# EAGLE design X13-Backplane (EAGLE 9.6.2)
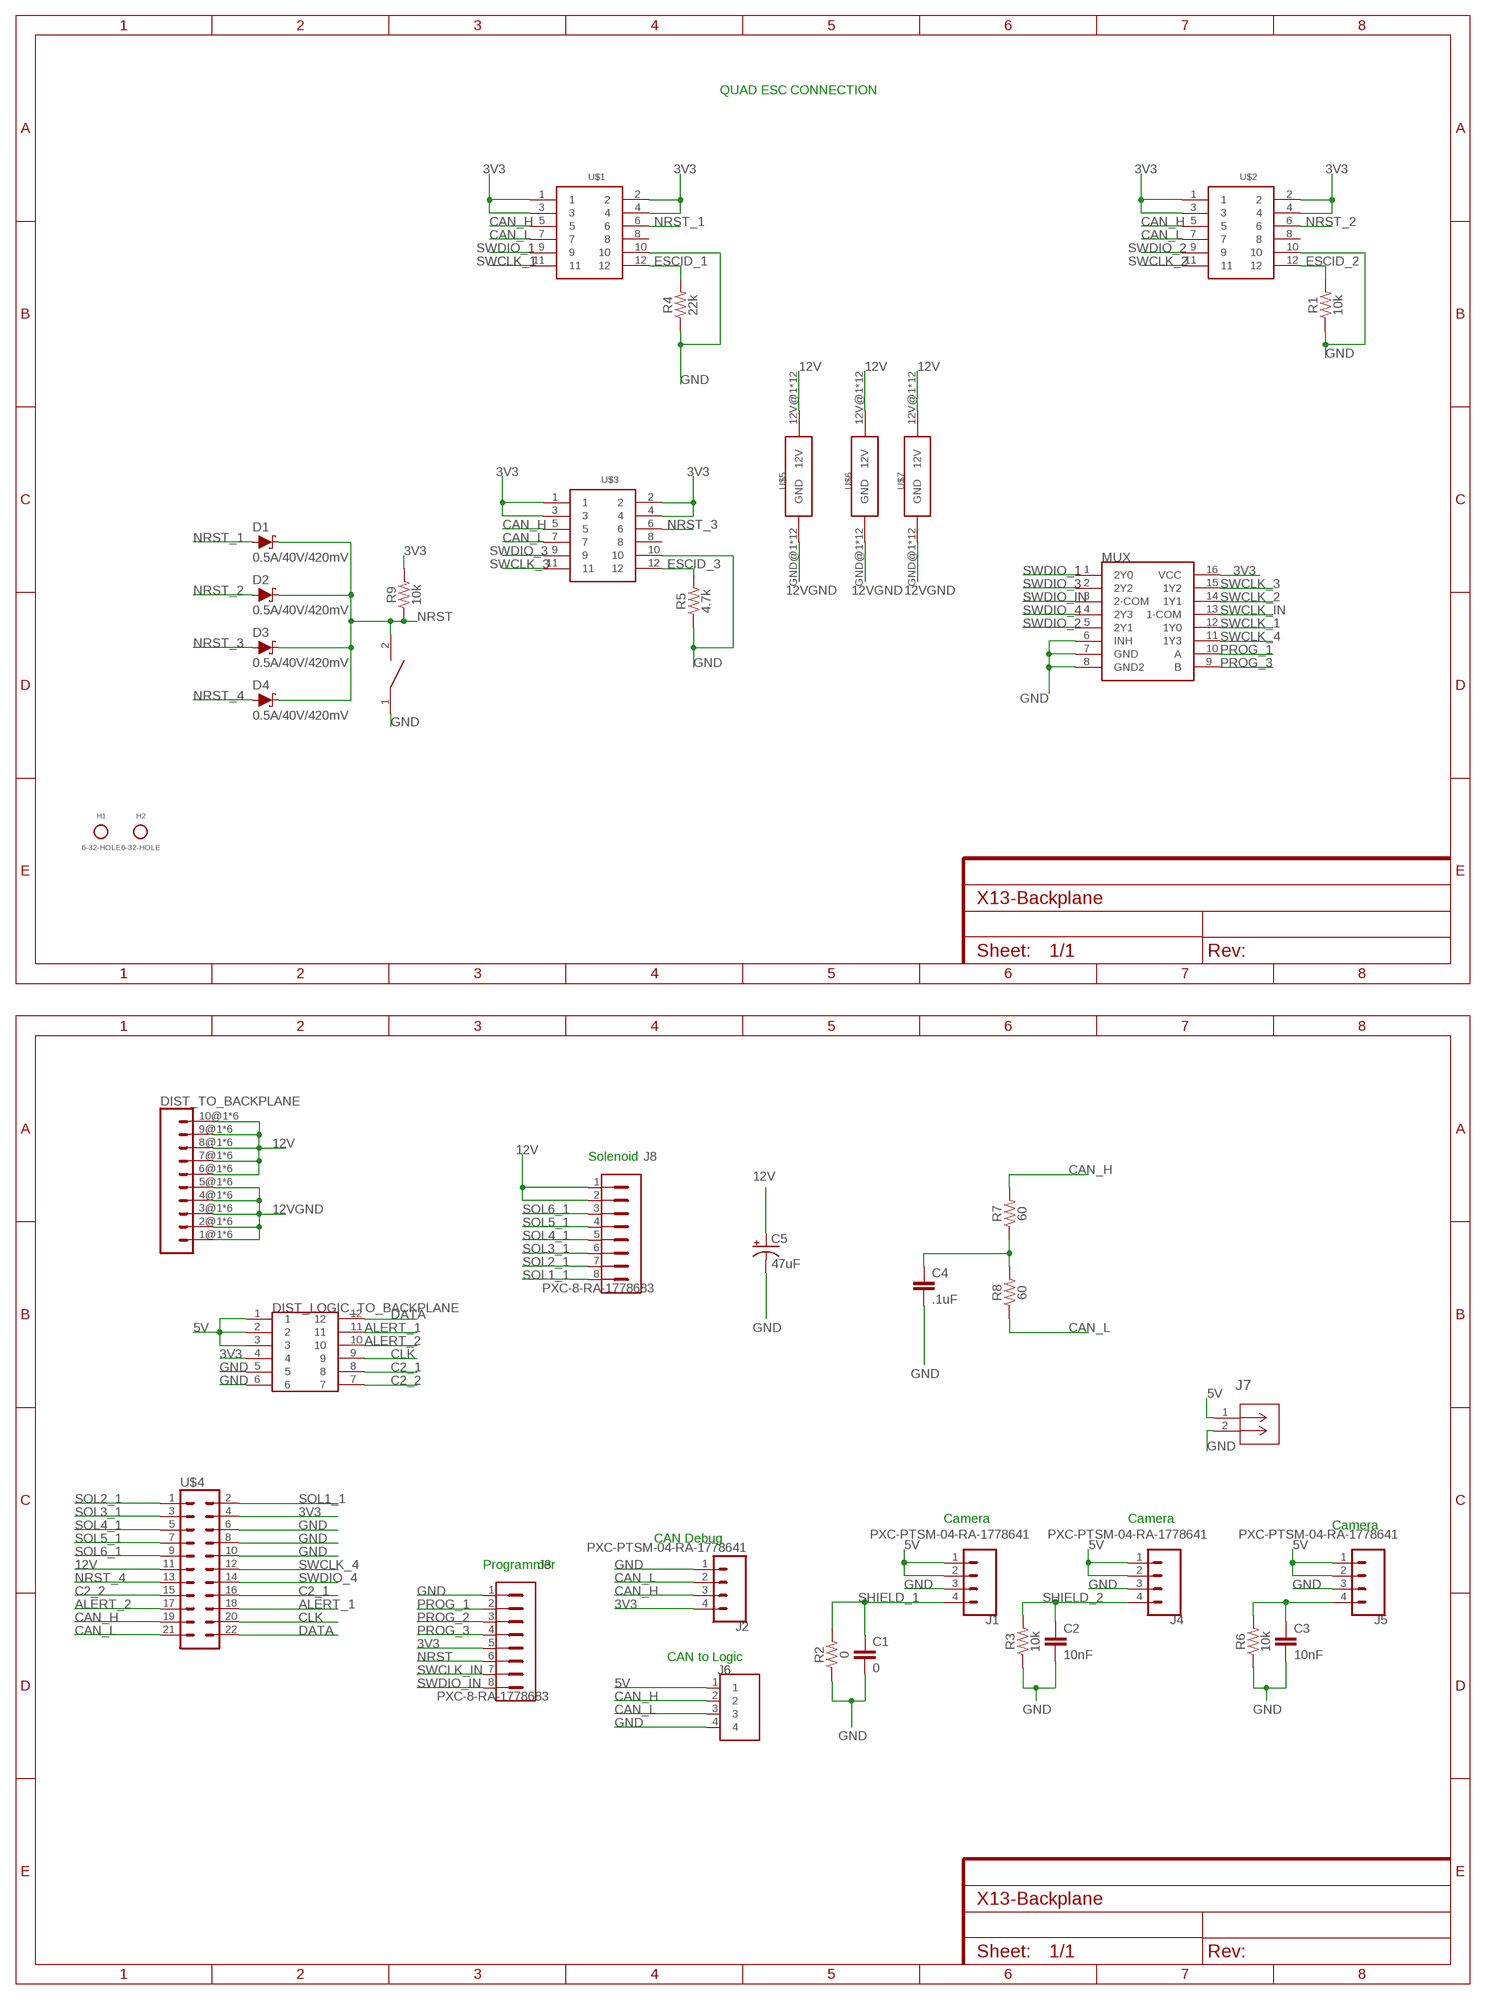
[diagram p0: schematic, sheet 1]

## Parts
C1  0  10NF-0603-50V-10%  [0603]
C2  10nF  10NF-0603-50V-10%  [0603]
C3  10nF  10NF-0603-50V-10%  [0603]
C4  .1uF  10NF-0603-50V-10%  [0603]
C5  47uF  47UF-POLAR-PANASONIC_D-35V-20%  [PANASONIC_D]
D1  0.5A/40V/420mV  DIODE-SCHOTTKY-PMEG4005EJ  [SOD-323]
D2  0.5A/40V/420mV  DIODE-SCHOTTKY-PMEG4005EJ  [SOD-323]
D3  0.5A/40V/420mV  DIODE-SCHOTTKY-PMEG4005EJ  [SOD-323]
D4  0.5A/40V/420mV  DIODE-SCHOTTKY-PMEG4005EJ  [SOD-323]
DIST_LOGIC_TO_BACKPLANE  IPL1-106-01-L-D-K  [IPL1-106-01-L-D-K]
DIST_TO_BACKPLANE  MPPT-10-01-01-L-RA-SD  [MPPT-10-01-01-L-RA-SD]
H1  6-32-HOLE  [6-32-HOLE]
H2  6-32-HOLE  [6-32-HOLE]
J1  PXC-PTSM-04-RA-1778641  [PXC-PTSM-04-RA-1778641]
J2  PXC-PTSM-04-RA-1778641  [PXC-PTSM-04-RA-1778641]
J3  PXC-8-RA-1778683  [PXC-8-RA-1778683]
J4  PXC-PTSM-04-RA-1778641  [PXC-PTSM-04-RA-1778641]
J5  PXC-PTSM-04-RA-1778641  [PXC-PTSM-04-RA-1778641]
J6  284512-4  [TE_284512-4]
J7  POE_TERMINAL  [CONN2_282834-2_TEC]
J8  PXC-8-RA-1778683  [PXC-8-RA-1778683]
MUX  TI-SN74LV4052A  [SOIC-16]
R1  10k  10KOHM-0603-1/10W-1%  [0603]
R2  0  10KOHM-0603-1/10W-1%  [0603]
R3  10k  10KOHM-0603-1/10W-1%  [0603]
R4  22k  26.7KOHM0603-1/10W-1%  [0603]
R5  4.7k  1KOHM-0603-1/10W-1%  [0603]
R6  10k  10KOHM-0603-1/10W-1%  [0603]
R7  60  68.1KOHM-0603-1/10W-1%  [0603]
R8  60  68.1KOHM-0603-1/10W-1%  [0603]
R9  10k  10KOHM-0603-1/10W-1%  [0603]
U$1  BACKPLANE_CONNECTORSBKP  [BACKPLANE_CONNECTORS_BKP]
U$2  BACKPLANE_CONNECTORSBKP  [BACKPLANE_CONNECTORS_BKP]
U$3  BACKPLANE_CONNECTORSBKP  [BACKPLANE_CONNECTORS_BKP]
U$4  BKP-TO-SOL  [BKP-TO-SOL_TMM-111-01-T-D]
U$5  BACKPLANE_ESC_ADAPTER_PWRBKP  [BACKPLANE_ESC_ADAPTER_BKP_PWR]
U$6  BACKPLANE_ESC_ADAPTER_PWRBKP  [BACKPLANE_ESC_ADAPTER_BKP_PWR]
U$7  BACKPLANE_ESC_ADAPTER_PWRBKP  [BACKPLANE_ESC_ADAPTER_BKP_PWR]
U$8  DISCRETECOMPONENTS_SWITCH  [DISCRETECOMPONENTS_SW_2512]

## Nets
3V3: DIST_LOGIC_TO_BACKPLANE.4 J2.4 J3.5 MUX.16(VCC) R9.2 U$1.1 U$1.2 U$1.3 U$1.4 U$2.1 U$2.2 U$2.3 U$2.4 U$3.1 U$3.2 U$3.3 U$3.4 U$4.4
5V: DIST_LOGIC_TO_BACKPLANE.1 DIST_LOGIC_TO_BACKPLANE.2 DIST_LOGIC_TO_BACKPLANE.3 J1.1 J1.2 J4.1 J4.2 J5.1 J5.2 J6.1 J7.1
12V: C5.+ DIST_TO_BACKPLANE.6@1 DIST_TO_BACKPLANE.6@2 DIST_TO_BACKPLANE.6@3 DIST_TO_BACKPLANE.6@4 DIST_TO_BACKPLANE.6@5 DIST_TO_BACKPLANE.6@6 DIST_TO_BACKPLANE.7@1 DIST_TO_BACKPLANE.7@2 DIST_TO_BACKPLANE.7@3 DIST_TO_BACKPLANE.7@4 DIST_TO_BACKPLANE.7@5 DIST_TO_BACKPLANE.7@6 DIST_TO_BACKPLANE.8@1 DIST_TO_BACKPLANE.8@2 DIST_TO_BACKPLANE.8@3 DIST_TO_BACKPLANE.8@4 DIST_TO_BACKPLANE.8@5 DIST_TO_BACKPLANE.8@6 DIST_TO_BACKPLANE.9@1 DIST_TO_BACKPLANE.9@2 DIST_TO_BACKPLANE.9@3 DIST_TO_BACKPLANE.9@4 DIST_TO_BACKPLANE.9@5 DIST_TO_BACKPLANE.9@6 DIST_TO_BACKPLANE.10@1 DIST_TO_BACKPLANE.10@2 DIST_TO_BACKPLANE.10@3 DIST_TO_BACKPLANE.10@4 DIST_TO_BACKPLANE.10@5 DIST_TO_BACKPLANE.10@6 J8.1 J8.2 U$4.11 U$5.12V@1(12V) U$5.12V@2(12V) U$5.12V@3(12V) U$5.12V@4(12V) U$5.12V@5(12V) U$5.12V@6(12V) U$5.12V@7(12V) U$5.12V@8(12V) U$5.12V@9(12V) U$5.12V@10(12V) U$5.12V@11(12V) U$5.12V@12(12V) U$6.12V@1(12V) U$6.12V@2(12V) U$6.12V@3(12V) U$6.12V@4(12V) U$6.12V@5(12V) U$6.12V@6(12V) U$6.12V@7(12V) U$6.12V@8(12V) U$6.12V@9(12V) U$6.12V@10(12V) U$6.12V@11(12V) U$6.12V@12(12V) U$7.12V@1(12V) U$7.12V@2(12V) U$7.12V@3(12V) U$7.12V@4(12V) U$7.12V@5(12V) U$7.12V@6(12V) U$7.12V@7(12V) U$7.12V@8(12V) U$7.12V@9(12V) U$7.12V@10(12V) U$7.12V@11(12V) U$7.12V@12(12V)
12VGND: DIST_TO_BACKPLANE.1@1 DIST_TO_BACKPLANE.1@2 DIST_TO_BACKPLANE.1@3 DIST_TO_BACKPLANE.1@4 DIST_TO_BACKPLANE.1@5 DIST_TO_BACKPLANE.1@6 DIST_TO_BACKPLANE.2@1 DIST_TO_BACKPLANE.2@2 DIST_TO_BACKPLANE.2@3 DIST_TO_BACKPLANE.2@4 DIST_TO_BACKPLANE.2@5 DIST_TO_BACKPLANE.2@6 DIST_TO_BACKPLANE.3@1 DIST_TO_BACKPLANE.3@2 DIST_TO_BACKPLANE.3@3 DIST_TO_BACKPLANE.3@4 DIST_TO_BACKPLANE.3@5 DIST_TO_BACKPLANE.3@6 DIST_TO_BACKPLANE.4@1 DIST_TO_BACKPLANE.4@2 DIST_TO_BACKPLANE.4@3 DIST_TO_BACKPLANE.4@4 DIST_TO_BACKPLANE.4@5 DIST_TO_BACKPLANE.4@6 DIST_TO_BACKPLANE.5@1 DIST_TO_BACKPLANE.5@2 DIST_TO_BACKPLANE.5@3 DIST_TO_BACKPLANE.5@4 DIST_TO_BACKPLANE.5@5 DIST_TO_BACKPLANE.5@6 U$5.GND@1(GND) U$5.GND@2(GND) U$5.GND@3(GND) U$5.GND@4(GND) U$5.GND@5(GND) U$5.GND@6(GND) U$5.GND@7(GND) U$5.GND@8(GND) U$5.GND@9(GND) U$5.GND@10(GND) U$5.GND@11(GND) U$5.GND@12(GND) U$6.GND@1(GND) U$6.GND@2(GND) U$6.GND@3(GND) U$6.GND@4(GND) U$6.GND@5(GND) U$6.GND@6(GND) U$6.GND@7(GND) U$6.GND@8(GND) U$6.GND@9(GND) U$6.GND@10(GND) U$6.GND@11(GND) U$6.GND@12(GND) U$7.GND@1(GND) U$7.GND@2(GND) U$7.GND@3(GND) U$7.GND@4(GND) U$7.GND@5(GND) U$7.GND@6(GND) U$7.GND@7(GND) U$7.GND@8(GND) U$7.GND@9(GND) U$7.GND@10(GND) U$7.GND@11(GND) U$7.GND@12(GND)
ALERT_1: DIST_LOGIC_TO_BACKPLANE.11 U$4.18
ALERT_2: DIST_LOGIC_TO_BACKPLANE.10 U$4.17
C2_1: DIST_LOGIC_TO_BACKPLANE.8 U$4.16
C2_2: DIST_LOGIC_TO_BACKPLANE.7 U$4.15
CAN_H: J2.3 J6.2 R7.2 U$1.5 U$2.5 U$3.5 U$4.19
CAN_L: J2.2 J6.3 R8.1 U$1.7 U$2.7 U$3.7 U$4.21
CLK: DIST_LOGIC_TO_BACKPLANE.9 U$4.20
DATA: DIST_LOGIC_TO_BACKPLANE.12 U$4.22
ESCID_1: R4.2 U$1.12
ESCID_2: R1.2 U$2.12
ESCID_3: R5.2 U$3.12
GND: C1.2 C2.2 C3.2 C4.2 C5.- DIST_LOGIC_TO_BACKPLANE.5 DIST_LOGIC_TO_BACKPLANE.6 J1.3 J2.1 J3.1 J4.3 J5.3 J6.4 J7.2 MUX.6(INH) MUX.7(GND) MUX.8(GND2) R1.1 R2.1 R3.1 R4.1 R5.1 R6.1 U$1.10 U$2.10 U$3.10 U$4.6 U$4.8 U$4.10 U$8.1
N$3: C4.1 R7.1 R8.2
NRST: D1.C D2.C D3.C D4.C J3.6 R9.1 U$8.2
NRST_1: D1.A U$1.6
NRST_2: D2.A U$2.6
NRST_3: D3.A U$3.6
NRST_4: D4.A U$4.13
PROG_1: J3.2 MUX.10(A)
PROG_2: J3.3
PROG_3: J3.4 MUX.9(B)
SHIELD_1: C1.1 J1.4 R2.2
SHIELD_2: C2.1 J4.4 R3.2
SHIELD_3: C3.1 J5.4 R6.2
SOL1_1: J8.8 U$4.2
SOL2_1: J8.7 U$4.1
SOL3_1: J8.6 U$4.3
SOL4_1: J8.5 U$4.5
SOL5_1: J8.4 U$4.7
SOL6_1: J8.3 U$4.9
SWCLK_1: MUX.12(1Y0) U$1.11
SWCLK_2: MUX.14(1Y1) U$2.11
SWCLK_3: MUX.15(1Y2) U$3.11
SWCLK_4: MUX.11(1Y3) U$4.12
SWCLK_IN: J3.7 MUX.13(1-COM)
SWDIO_1: MUX.1(2Y0) U$1.9
SWDIO_2: MUX.5(2Y1) U$2.9
SWDIO_3: MUX.2(2Y2) U$3.9
SWDIO_4: MUX.4(2Y3) U$4.14
SWDIO_IN: J3.8 MUX.3(2-COM)
Unconnected: U$1.8 U$2.8 U$3.8

## Notes on the sheet
- QUAD ESC CONNECTION
- Solenoid
- Camera | Camera
- Camera
- CAN Debug
- Programmer
- CAN to Logic

## Library data of the parts
C1 C4 = SparkFun-Capacitors:10NF: 0.01uF/10nF/10,000pF ceramic capacitors A capacitor is a passive two-terminal electrical component used to store electrical energy temporarily in an electric field. CAP-09321; PROD_ID: CAP-00867; VALUE: 10nF
C2 C3 = SparkFun-Capacitors:10NF: 0.01uF/10nF/10,000pF ceramic capacitors A capacitor is a passive two-terminal electrical component used to store electrical energy temporarily in an electric field. CAP-09321; PROD_ID: CAP-00867
C5 = Panasonic 47 uF cap - EEE-1CA470SP:47UF-POLAR: 47µF polarized capacitors A capacitor is a passive two-terminal electrical component used to store electrical energy temporarily in an electric field.; PROD_ID: CAP-08478
D1-D4 = SparkFun-DiscreteSemi:DIODE-SCHOTTKY: Schottky diode A Schottky diode is a semiconductor diode which has a low forward voltage drop and a very fast switching action.; PROD_ID: DIO-10955
DIST_LOGIC_TO_BACKPLANE = Backplane_Dist_Logic_Connector:IPL1-106-01-L-D-K
DIST_TO_BACKPLANE = Samtec MPPT Hermaphoditic 10 pos - MPPT-10-01-01-L-RA-SD:MPPT-10-01-01-L-RA-SD: Samtec MPPT Connector Right Angle Vertically mating Non-gendered https://www.samtec.com/products/mppt-10-01-01-l-ra-sd
H1 H2 = Mounting Holes:6-32-HOLE
J1 J2 J4 J5 = Phoenix Contact PTSM-04-V-1778573:PXC-PTSM-04-RA-1778641
J3 J8 = Phoenix Contact PTSM 8 pin:PXC-8-RA-1778683
J6 = te 3.5m mm horiz 4 pin:284512-4; MANUFACTURER: TE; PARTREV: R; STANDARD: Manufacturer Recommendations
J7 = Dist_POE:POE_TERMINAL; BUILT_BY: EMA_UL_Team; COPYRIGHT: Copyright (C) 2016 Accelerated Designs. All rights reserved; DESCRIPTION: TERMI-BLOK PCB MOUNT, 90 2P.; MANUFACTURER_PART_NUMBER: 282834-2; PITCH_MM_: 2.54; POSITIONS: 2; PRODUCT: Terminal Block Headers & Receptacles; ROWS-CONFIG: 1; SOURCELIBRARY: TE_Connectivity-2018-03-16; TE_PART_NUMBER: 282834-2; TYPE: Receptacle; VENDOR: TE Connectivity
MUX = BackplaneMUX:TI-SN74LV4052A
R1 R3 R6 R9 = SparkFun-Resistors:10KOHM: 10kΩ resistor A resistor is a passive two-terminal electrical component that implements electrical resistance as a circuit element. Resistors act to reduce current flow, and, at the same time, act to lower voltage levels within circuits. - Wikipedia; PROD_ID: RES-00824
R2 = SparkFun-Resistors:10KOHM: 10kΩ resistor A resistor is a passive two-terminal electrical component that implements electrical resistance as a circuit element. Resistors act to reduce current flow, and, at the same time, act to lower voltage levels within circuits. - Wikipedia; PROD_ID: RES-00824; VALUE: 10k
R4 = SparkFun-Resistors:26.7KOHM: 26.7kΩ resistor A resistor is a passive two-terminal electrical component that implements electrical resistance as a circuit element. Resistors act to reduce current flow, and, at the same time, act to lower voltage levels within circuits. - Wikipedia; PROD_ID: RES-12186; VALUE: 26.7k
R5 = SparkFun-Resistors:1KOHM: 1kΩ resistor A resistor is a passive two-terminal electrical component that implements electrical resistance as a circuit element. Resistors act to reduce current flow, and, at the same time, act to lower voltage levels within circuits. - Wikipedia; PROD_ID: RES-07856; VALUE: 1k
R7 R8 = SparkFun-Resistors:68.1KOHM: 68.1kΩ resistor A resistor is a passive two-terminal electrical component that implements electrical resistance as a circuit element. Resistors act to reduce current flow, and, at the same time, act to lower voltage levels within circuits. - Wikipedia; PROD_ID: RES-09380; VALUE: 68.1k
U$1-U$3 = BLHeli_32 45A:BACKPLANE_CONNECTORS: Use samtec TMM and MMS
U$4 = Solenoid Connector (backplane side):BKP-TO-SOL
U$5-U$7 = Backplane_ESC_adapter:BACKPLANE_ESC_ADAPTER_PWR
U$8 = OTHER, Push button - FSM2JMTR:DISCRETECOMPONENTS_SWITCH: TE Connectivity FSM2JMTR Switch

## Net classes
0 default: width 0.203 mm

## Board
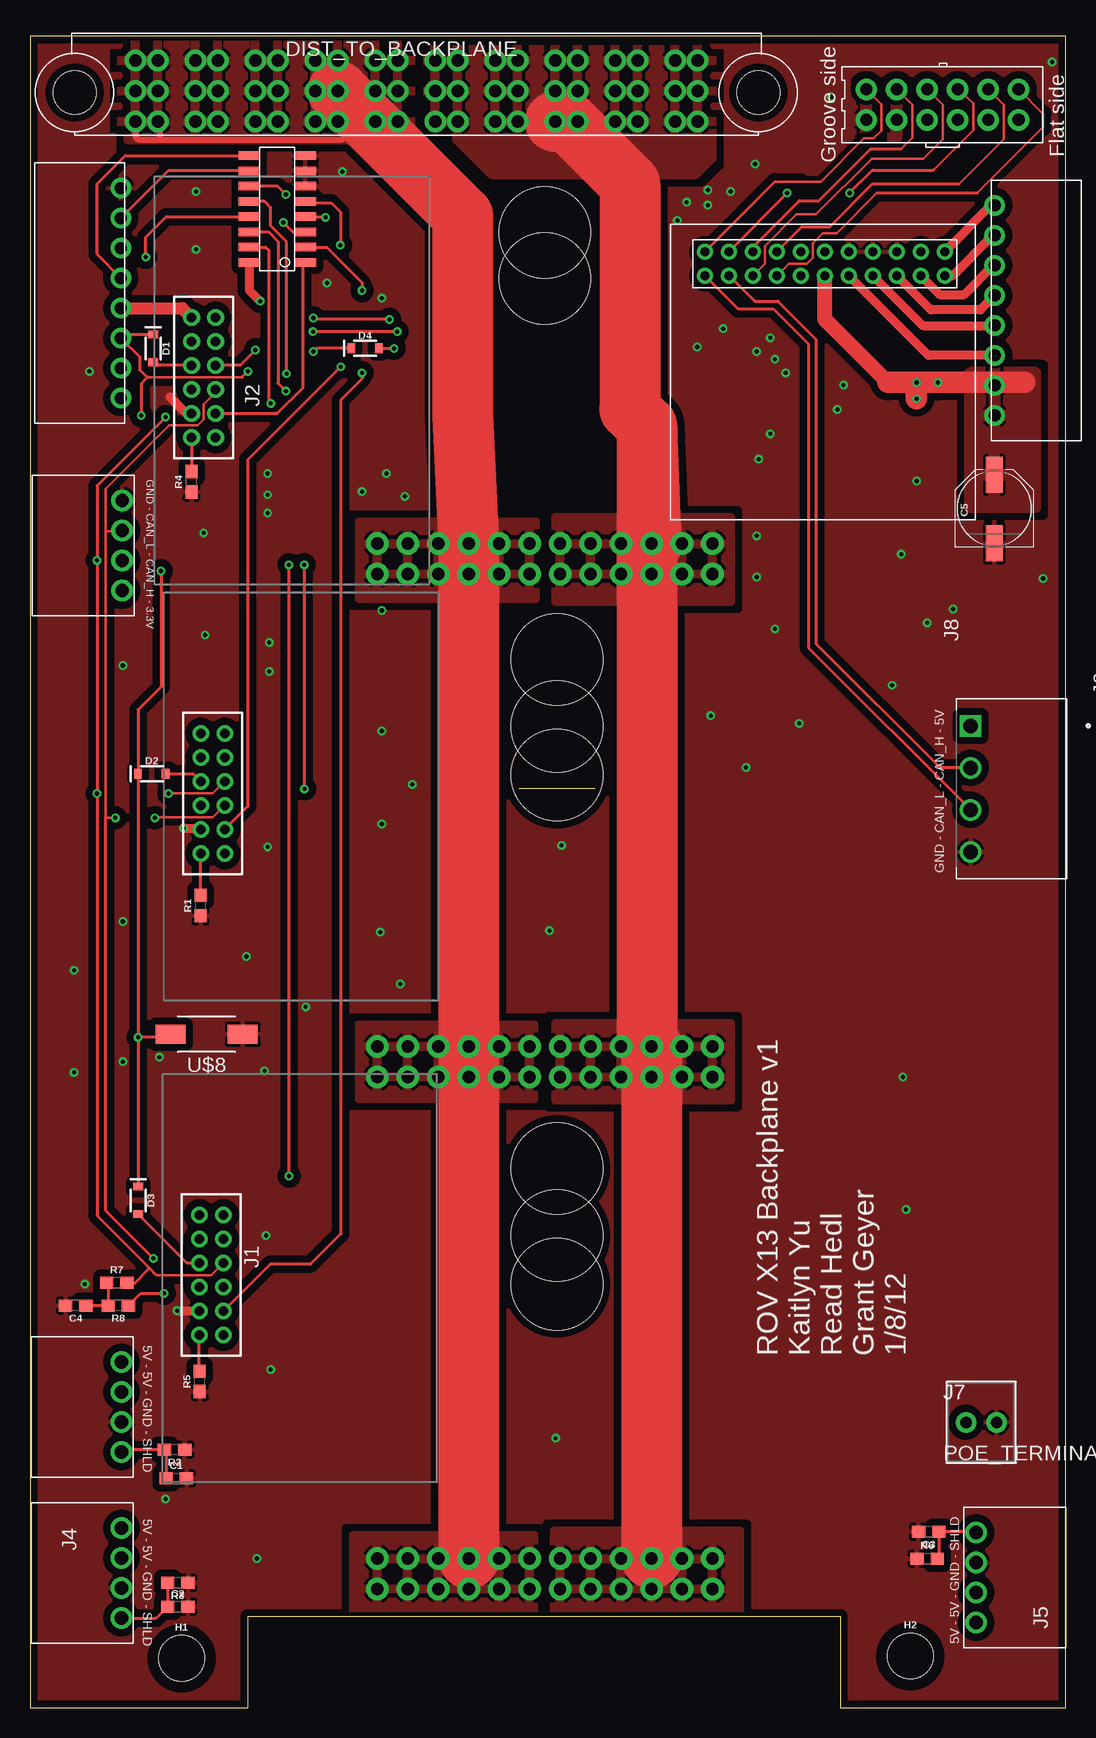
[diagram p1: board, top side]
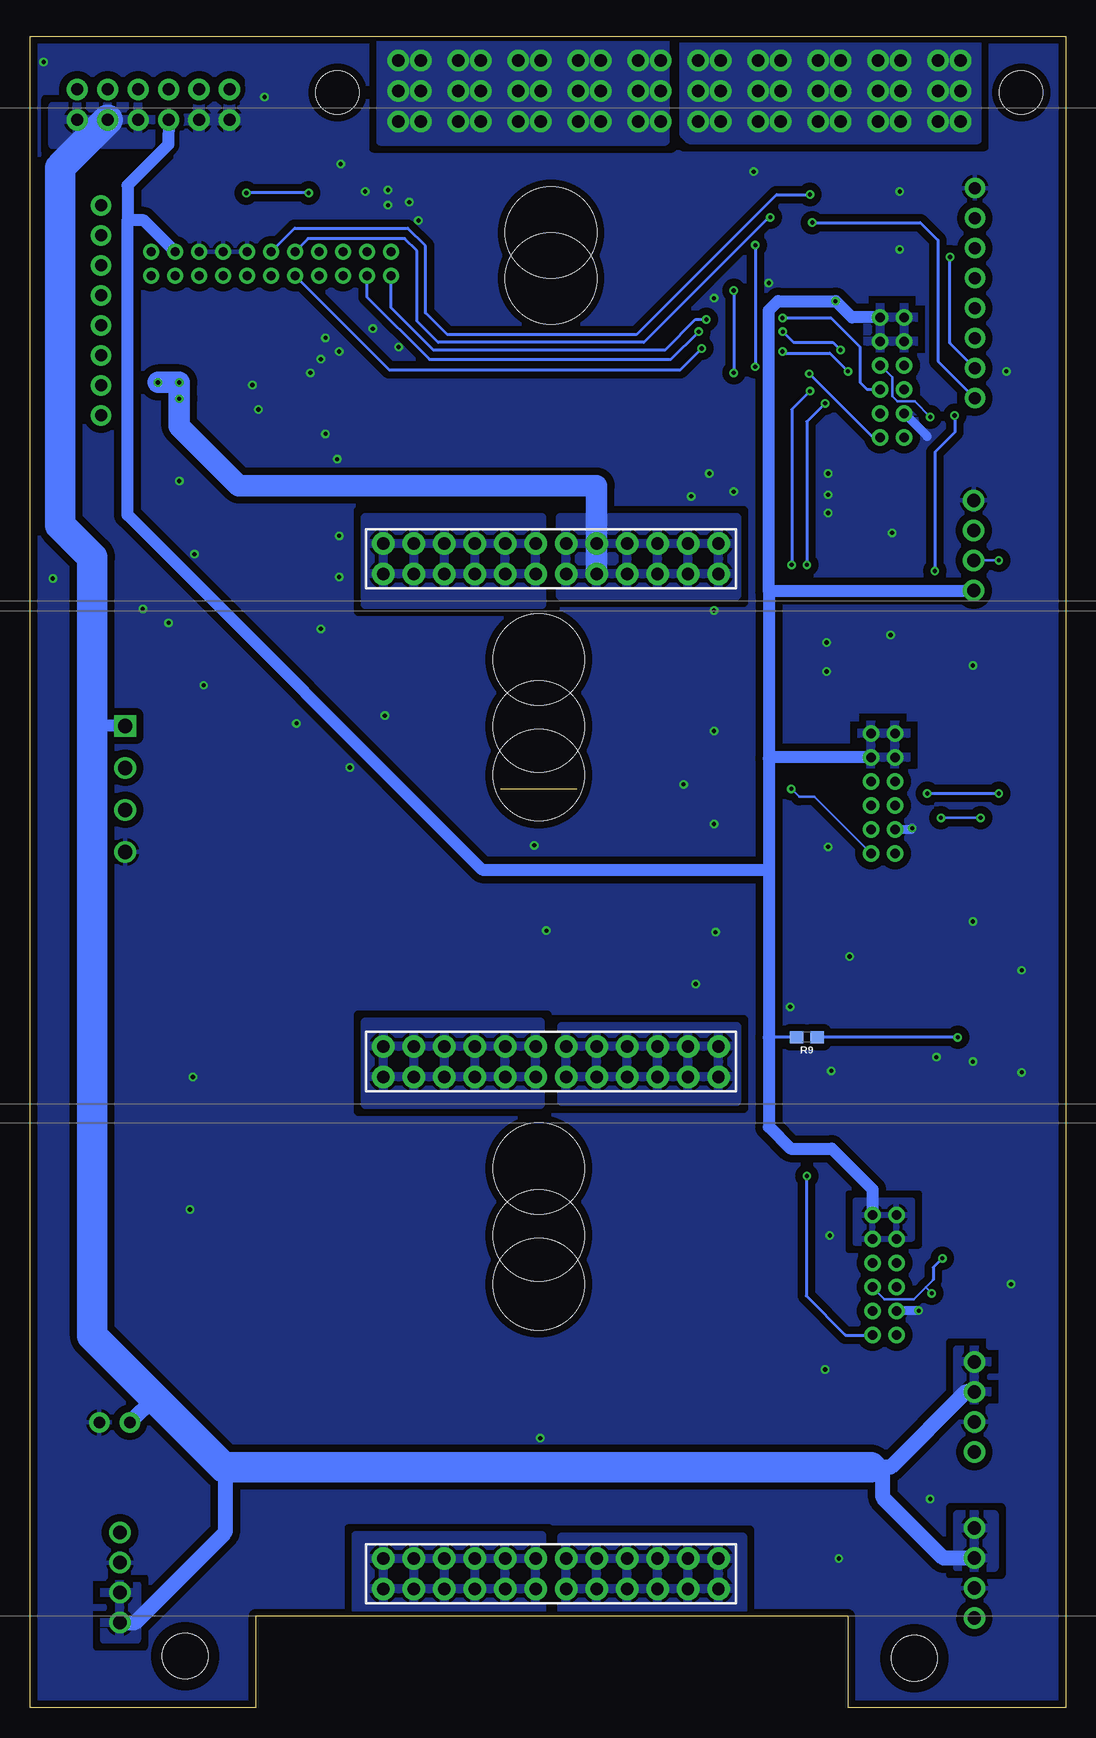
[diagram p2: board, bottom side, seen from below]

Size 86.36 x 139.32 mm. Coordinates in mm from the lower left corner, seen from the top.
Outline: 47.12,76.58 40.77,76.58
Outline: 0,0 18.16,0 18.16,7.62 67.56,7.62 67.56,0 86.36,0 86.36,139.32 0,139.32 0,0
Copper layers (1*16): Top 0.0356mm / dielectric 1.5011mm / Bottom 0.0356mm
Design rules "ECE_Senior_Design": minimum track width 8mil, minimum drill 13mil, track to track 8mil, track to pad 8mil, pad to pad 6mil, via to via 8mil, smd to smd 6mil, copper to edge 15mil, drill to drill 8mil, minimum pad ring 7mil, minimum via ring 7mil, stop-mask expansion 3mil, vias tented up to drill 0mil, thermal gap 10mil
Holes 7.62 mm at 43.94,44.96 43.94,39.37 43.94,35.31 43.94,87.38 43.94,81.79 43.94,77.72 42.93,122.94 42.93,119.13

### Footprints (pad centres in the part's own frame; a part is rotated, then mirrored left to right if it is on the bottom)
0603 = smd 1.1 x 1: 1 -0.85,0; 2 0.85,0
PANASONIC_D = smd 3 x 1.4: + 2.8,0; - -2.9,0
SOD-323 = smd 0.63 x 0.83: A 1.15,0; C -1.15,0
IPL1-106-01-L-D-K = drill 1.016 pad 1.778: 1 0,0; 2 2.54,0; 3 5.08,0; 4 7.62,0; 5 10.16,0; 6 12.7,0; 7 0,-2.54; 8 2.54,-2.54; 9 5.08,-2.54; 10 7.62,-2.54; 11 10.16,-2.54; 12 12.7,-2.54
MPPT-10-01-01-L-RA-SD = drill 1.04 pad 1.8: 1@1 -23.44,2.26; 1@2 -21.56,2.26; 1@3 -23.44,4.8; 1@4 -21.56,4.8; 1@5 -23.44,7.34; 1@6 -21.56,7.34; 2@1 -18.44,2.26; 2@2 -16.56,2.26; 2@3 -18.44,4.8; 2@4 -16.56,4.8; 2@5 -18.44,7.34; 2@6 -16.56,7.34; 3@1 -13.44,2.26; 3@2 -11.56,2.26; 3@3 -13.44,4.8; 3@4 -11.56,4.8; 3@5 -13.44,7.34; 3@6 -11.56,7.34; 4@1 -8.44,2.26; 4@2 -6.56,2.26; 4@3 -8.44,4.8; 4@4 -6.56,4.8; 4@5 -8.44,7.34; 4@6 -6.56,7.34; 5@1 -3.44,2.26; 5@2 -1.56,2.26; 5@3 -3.44,4.8; 5@4 -1.56,4.8; 5@5 -3.44,7.34; 5@6 -1.56,7.34; 6@1 1.56,2.26; 6@2 3.44,2.26; 6@3 1.56,4.8; 6@4 3.44,4.8; 6@5 1.56,7.34; 6@6 3.44,7.34; 7@1 6.56,2.26; 7@2 8.44,2.26; 7@3 6.56,4.8; 7@4 8.44,4.8; 7@5 6.56,7.34; 7@6 8.44,7.34; 8@1 11.56,2.26; 8@2 13.44,2.26; 8@3 11.56,4.8; 8@4 13.44,4.8; 8@5 11.56,7.34; 8@6 13.44,7.34; 9@1 16.56,2.26; 9@2 18.44,2.26; 9@3 16.56,4.8; 9@4 18.44,4.8; 9@5 16.56,7.34; 9@6 18.44,7.34; 10@1 21.56,2.26; 10@2 23.44,2.26; 10@3 21.56,4.8; 10@4 23.44,4.8; 10@5 21.56,7.34; 10@6 23.44,7.34 | hole 3.6: 28.5,4.93; -28.5,4.93
6-32-HOLE = hole 3.81: 0,0
PXC-PTSM-04-RA-1778641 = drill 1.1 pad 1.8: 1 0,0; 2 2.5,0; 3 5,0; 4 7.5,0
PXC-8-RA-1778683 = drill 1 pad 1.7: 1 2.1,7.2; 2 4.6,7.2; 3 7.1,7.2; 4 9.6,7.2; 5 12.1,7.2; 6 14.6,7.2; 7 17.1,7.2; 8 19.6,7.2
TE_284512-4 = drill 1.2 square: 1 -5.25,0 | drill 1.2: 2 -1.75,0; 3 1.75,0; 4 5.25,0
CONN2_282834-2_TEC = drill 0.965 pad 1.7: 1 0,0; 2 2.54,0
SOIC-16 = smd 1.78 x 0.72: 1 0,0; 2 0,-1.27; 3 0,-2.54; 4 0,-3.81; 5 0,-5.08; 6 0,-6.35; 7 0,-7.62; 8 0,-8.89; 9 4.68,-8.89; 10 4.68,-7.62; 11 4.68,-6.35; 12 4.68,-5.08; 13 4.68,-3.81; 14 4.68,-2.54; 15 4.68,-1.27; 16 4.68,0
BACKPLANE_CONNECTORS_BKP = drill 0.79 pad 1.39: 1 -1,-5; 2 1,-5; 3 -1,-3; 4 1,-3; 5 -1,-1; 6 1,-1; 7 -1,1; 8 1,1; 9 -1,3; 10 1,3; 11 -1,5; 12 1,5
BKP-TO-SOL_TMM-111-01-T-D = drill 0.75 pad 1.35: 1 0,2; 2 0,0; 3 2,2; 4 2,0; 5 4,2; 6 4,0; 7 6,2; 8 6,0; 9 8,2; 10 8,0; 11 10,2; 12 10,0; 13 12,2; 14 12,0; 15 14,2; 16 14,0; 17 16,2; 18 16,0; 19 18,2; 20 18,0; 21 20,2; 22 20,0
BACKPLANE_ESC_ADAPTER_BKP_PWR = drill 1.016 pad 1.88: 12V@1 65.024,36.322; 12V@2 65.024,38.862; 12V@3 62.484,36.322; 12V@4 62.484,38.862; 12V@5 59.944,36.322; 12V@6 59.944,38.862; 12V@7 57.404,36.322; 12V@8 57.404,38.862; 12V@9 54.864,36.322; 12V@10 54.864,38.862; 12V@11 52.324,36.322; 12V@12 52.324,38.862; GND@1 49.784,38.862; GND@2 49.784,36.322; GND@3 47.244,38.862; GND@4 47.244,36.322; GND@5 44.704,38.862; GND@6 44.704,36.322; GND@7 42.164,38.862; GND@8 42.164,36.322; GND@9 39.624,38.862; GND@10 39.624,36.322; GND@11 37.084,38.862; GND@12 37.084,36.322
DISCRETECOMPONENTS_SW_2512 = smd 2.5 x 1.6: 1 -3,0; 2 3,0

### Placement (x,y rotation side)
C1  12.19,19.11 0 top
C2  12.32,8.45 0 top
C3  74.93,14.67 180 top
C4  3.81,33.53 180 top
C5  80.39,99.95 90 top
D1  10.29,113.28 270 top
D2  10.16,77.85 0 top
D3  9.02,42.29 270 top
D4  27.94,113.28 0 top
DIST_LOGIC_TO_BACKPLANE  82.42,132.33 180 top
DIST_TO_BACKPLANE  32.23,139.54 180 top
H1  12.64,4.13 0 top
H2  73.41,4.32 0 top
J1  7.62,28.83 270 top
J2  7.68,100.62 270 top
J3  0.38,128.75 270 top
J4  7.62,14.99 270 top
J5  78.87,7.11 90 top
J6  78.42,76.58 270 top
J7  78.04,23.78 0 top
J8  87.63,105.6 90 top
MUX  22.96,120.46 180 top
R1  14.22,66.87 90 top
R2  12.06,21.53 180 top
R3  12.32,10.41 180 top
R4  13.46,102.17 90 top
R5  14.16,27.21 90 top
R6  74.8,12.45 0 top
R7  7.24,35.43 0 top
R8  7.37,33.53 180 top
R9  21.59,55.88 180 bottom
U$1  14.48,110.87 180 top
U$2  15.24,76.2 180 top
U$3  15.11,36.07 180 top
U$4  76.26,121.35 180 top
U$5  93.98,48.77 180 top
U$6  93.98,91.44 180 top
U$7  93.98,133.35 180 top
U$8  14.73,56.13 180 top

### Tracks (layer width: path | path; a pad name or v marks a point on that pad's centre or on a via)
3V3  (via drill 0.35)
  Top 0.762: MUX.16 18.27,118.15 v19.2,117.22
  Top 1.016: J3.5 12.7,116.65 U$1.2
  Bottom 0.254: R9.2 24.76,55.88
  Bottom 0.762: 24.69,79.2 24.76,79.12
  Bottom 1.016: 24.76,93.09 24.76,79.12 24.76,69.85 | U$2.3 24.69,79.2 | 24.76,93.09 24.76,116.46 24,117.22 v19.2,117.22 19.18,117.22 17.83,115.87 U$1.1 | DIST_LOGIC_TO_BACKPLANE.4 74.83,130.28 78.23,126.87 78.23,123.95 | 78.23,123.95 76.87,123.95 U$4.4 | 78.23,123.95 78.23,99.42 48.66,69.85 24.76,69.85 | U$3.1 16.11,43.22 19.51,46.61 22.96,46.61 24.76,48.41 24.76,55.88 24.76,69.85 | J2.4 7.71,93.09 24.76,93.09
  pour Bottom: 12.7,116.46 12.7,113.28 16.51,113.28 16.51,116.71 12.83,116.71 12.7,116.59
  pour Bottom: 13.33,81.92 13.33,78.61 17.02,78.61 17.02,81.92
  pour Bottom: 12.83,42.29 12.83,39.12 13.21,38.73 17.53,38.73 17.53,42.29
5V
  Bottom 1.016: J6.1 80.94,81.83 81.15,82.04
  Bottom 1.27: J1.2 8.34,26.33 14.61,20.07 15.24,20.07 | J5.1 77.6,7.11 70.1,14.61 70.1,19.94 70.23,20.07 | 15.24,20.07 16.26,20.07 | J4.2 10.2,12.49 15.24,17.53 15.24,20.07 | J7.1 76.01,25.81 76.01,25.84
  Bottom 2.54: 16.26,20.07 70.23,20.07 76.01,25.84 81.15,30.99 81.15,82.04 81.15,95.89 83.82,98.55 83.82,128.35 83.64,128.53 83.64,128.57 DIST_LOGIC_TO_BACKPLANE.2
  pour Bottom: 76.3,133.48 76.3,130.25 84.45,130.25 84.45,133.48
  pour Bottom: 77.47,10.29 77.47,5.71 80.14,5.71 80.14,10.29
  pour Bottom: 5.97,16.13 5.97,11.68 9.02,11.68 9.02,16.13
  pour Bottom: 6.6,29.84 6.6,25.65 9.02,25.65 9.02,29.84
12V  (via drill 0.35)
  Top 0.508: DIST_TO_BACKPLANE.10@5 10.79,132.07 10.79,130.68 | DIST_TO_BACKPLANE.10@6 8.79,130.91 9.02,130.68 10.79,130.68 | 10.79,130.68 26.04,130.68
  Top 1.27: 71.53,110.45 66.26,115.72 U$4.11
  Top 1.778: 82.93,110.45 v75.69,110.45 v73.91,110.45 | v73.91,110.45 71.53,110.45 | v73.91,109.09 v73.91,110.45
  Top 5.08: DIST_TO_BACKPLANE.7@3 36.07,124.34 36.07,107.7 U$7.12V@7 U$6.12V@7 U$5.12V@7
  Bottom 1.778: U$7.12V@10 39.12,101.85 68.96,101.85 73.91,106.81 v73.91,109.09 v73.91,110.45 v75.69,110.45
  pour Top: 7.62,138.94 7.62,131.19 8.13,130.68 31.75,130.68 31.75,138.94
  pour Bottom (isolate 0.508, no thermals): 31.88,138.94 31.88,131.19 31.37,130.68 7.37,130.68 7.37,138.94
  pour Top: 27.43,98.81 27.43,92.46 42.16,92.46 42.16,98.81
  pour Bottom: 42.16,99.19 42.16,92.71 27.43,92.71 27.43,99.19
  pour Top: 27.43,56.9 27.43,50.8 42.04,50.8 42.04,56.9
  pour Bottom: 42.04,56.77 42.04,50.55 27.43,50.55 27.43,56.77
  pour Top: 26.92,14.35 26.92,8.13 42.04,8.13 42.04,14.35
  pour Bottom: 42.04,14.22 42.04,8.13 26.92,8.13 26.92,14.22
  pour Top: 78.36,111.25 78.36,100.08 83.82,100.08 83.82,111.25
12VGND
  Top 5.08: DIST_TO_BACKPLANE.3@6 44.8,132.2 50.01,126.99 50.01,108.23 51.44,106.81 | 51.44,106.81 51.44,55.5 U$6.GND@8 U$5.GND@8 | U$7.GND@8 51.44,106.81
  pour Top (isolate 0.508): 33.15,138.18 33.15,133.1 38.48,127.76 55.5,127.76 56.9,129.16 56.9,138.18
  pour Bottom (no thermals): 57.15,138.94 57.15,130.56 33.4,130.56 33.4,138.94
  pour Top: 43.82,99.19 43.82,92.2 58.42,92.2 58.42,99.19
  pour Bottom: 58.42,99.19 58.42,91.95 43.69,91.95 43.69,99.19
  pour Top: 43.82,57.02 43.82,50.67 58.42,50.67 58.42,57.02
  pour Bottom: 58.42,57.15 58.42,50.29 43.82,50.29 43.82,57.15
  pour Top: 43.69,14.73 43.69,8.13 59.18,8.13 59.18,14.73
  pour Bottom: 59.18,14.35 59.18,8 43.69,8 43.69,14.35
ALERT_1
  Top 0.203: 72.64,129.92 73.56,130.84 73.56,133.6 DIST_LOGIC_TO_BACKPLANE.11
  Top 0.254: U$4.18 60.26,121.73 64.14,125.6 65.79,125.6 70.1,129.92 72.64,129.92
ALERT_2
  Top 0.203: U$4.17 61.26,120.34 61.26,121.82 63.9,124.46 65.53,124.46 70.17,129.09 74.49,129.09 76.12,130.73 76.12,133.57 DIST_LOGIC_TO_BACKPLANE.10
C2_1
  Top 0.203: DIST_LOGIC_TO_BACKPLANE.8 81.18,133.6 81.18,130.71 77.47,127
  Top 0.254: U$4.16 64.36,123.44 66.67,123.44 70.23,127 77.47,127
C2_2
  Top 0.203: U$4.15 63.26,120.34 64.77,120.34 65.28,120.85 65.28,122.05 66.11,122.88 67.26,122.88 70.61,126.24 | 78.99,126.24 84.45,131.7 84.45,132.86 DIST_LOGIC_TO_BACKPLANE.7
  Top 0.254: 70.61,126.24 78.99,126.24
CAN_H  (via drill 0.35)
  Top 0.203: U$3.5 15.11,36.07 10.54,36.07 | U$2.5 15.24,76.2 v11.56,76.2
  Top 0.254: v30.61,114.68 v23.6,114.68 | v18.8,113.16 17.51,111.87 U$1.5 | v11.3,107.57 5.59,101.85 v5.59,95.63 v5.59,76.2 5.59,41.02 9.91,36.7 | 9.91,36.7 9.91,36.58 8.76,35.43 R7.2 | 9.91,36.7 10.54,36.07 | U$4.19 58.32,119.35 60.45,117.22 62.36,117.22 65.53,114.05 65.53,88.68 75.88,78.33 J6.2
  Bottom 0.203: U$1.5 14.48,110.87 14.48,109.31 14.03,108.87 12.61,108.87 v11.3,107.57 | J2.3 5.6,95.62 v5.59,95.63
  Bottom 0.254: v23.6,114.68 22.71,113.79 19.43,113.79 v18.8,113.16 | v11.56,76.2 v5.59,76.2 | v30.61,114.68 32.92,112.36 53.06,112.36 58.26,117.57 U$4.19
CAN_L  (via drill 0.35)
  Top 0.203: U$1.7 15.48,109.62 14.48,108.62 14.48,107.37 13.98,106.87 11.62,106.87 6.33,101.58 6.33,98.04 | 6.33,98.04 6.33,74.2 | U$2.7 15.24,74.2 13.83,74.2 10.45,74.2 v10.41,74.17 | J2.2 7.61,98.04 6.33,98.04 | v7.11,74.17 6.33,74.17
  Top 0.254: v29.97,115.7 23.75,115.7 v23.62,115.82 | 6.33,74.2 6.33,74.17 6.33,41.43 v10.29,37.47 | R8.1 9.23,34.54 v11.18,34.54 | U$4.21 59.03,116.59 61.98,116.59 64.9,113.67 64.9,88.36 J6.3
  Bottom 0.203: 11.68,35.05 12.67,34.07 15.11,34.07 U$3.7 | 11.68,35.05 11.05,35.69 | v11.18,34.54 11.68,35.05 | v10.41,74.17 v7.11,74.17
  Bottom 0.254: v23.62,115.82 19.58,115.82 17.17,113.41 17.17,110.47 16.58,109.87 U$1.7 | v10.29,37.47 11.05,36.7 11.05,35.69 | v29.97,115.7 30.86,115.7 33.4,113.16 52.74,113.16 56.26,116.68 U$4.21
CLK  (via drill 0.35)
  Top 0.203: 75.31,128.14 78.65,131.48 78.63,133.71 DIST_LOGIC_TO_BACKPLANE.9
  Top 0.254: U$4.20 63.12,126.2 v63.12,126.24 | v68.33,126.24 70.23,128.14 75.31,128.14
  Bottom 0.254: v63.12,126.24 v68.33,126.24
DATA
  Top 0.203: DIST_LOGIC_TO_BACKPLANE.12 70.99,133.62 70.99,131.44 70.33,130.78 69.52,130.78 65.93,127.2 62.11,127.2
  Top 0.254: U$4.22 62.11,127.2
ESCID_1
  Top 0.254: U$1.12 13.48,103.04 R4.2
ESCID_2
  Top 0.254: R1.2 14.22,71.18 U$2.12
ESCID_3
  Top 0.254: R5.2 14.11,28.11 U$3.12
GND  (via drill 0.35)
  Top 0.762: 13.03,107.87 11.68,109.22 | U$3.10 12.29,33.07 v12.26,33.1 | v12.8,73.3 14.14,73.3 U$2.10
  Bottom 0.762: U$1.10 11.56,105.95 | v12.26,33.1 14.08,33.1 U$3.10 | U$2.10 12.9,73.2 v12.8,73.3
  other vias: 14.61,89.41 19.56,53.09 14.48,97.92 72.64,96.14 26.04,128.02 66.8,134.24 60.58,113.03 58.42,126.36 60.58,94.23 27.69,101.35 29.34,91.44 60.45,128.65 60.58,97.66 61.72,106.17 76.96,91.57 62.1,89.92 71.88,85.22 59.69,78.36 31.24,100.97 29.72,102.87 29.34,81.41 29.34,73.66 18.03,62.61 10.79,54.23 72.77,52.58 73.02,41.53 56.52,125.22 56.52,126.49 53.98,123.95 54.74,125.48 57.79,114.94 55.63,113.41 61.72,114.17 62.1,112.39 62.99,111.25 67.31,108.2 67.82,110.24 60.75,104.06 73.91,102.23 84.45,94.11 11.3,17.4 18.92,12.45 13.84,121.54 43.31,64.77 31.88,76.96 19.81,71.75 4.57,35.31 20.07,28.19 19.68,39.37 43.82,22.48 74.8,90.42 56.77,82.68 64.13,82.04 29.21,64.64 22.99,58.42 85.22,137.16 19.81,102.87 19.81,101.09 19.81,99.57 19.94,88.77 19.94,86.36 3.68,61.47 3.68,52.96 30.86,60.33 4.95,111.38 13.84,126.36 24.76,118.75 29.34,117.47 7.75,86.87 7.75,65.53 7.75,53.85 44.32,71.88
  pour Top (isolate 0.61, rank 6): -2.54,142.24 -2.54,-2.54 96.52,-2.54 96.52,130.05 94.74,130.05 94.74,142.24
  pour Bottom (isolate 0.61, rank 6): 93.6,-0.64 -5.46,-0.64 -5.46,144.15 93.6,144.15
  pour Bottom (isolate 0.406): 64.64,135.38 73.91,135.38 73.91,128.02 64.64,128.02
  pour Top (isolate 0.406): 65.02,135.41 74.17,135.41 74.17,128.02 65.02,128.02
N$3
  Top 0.254: R7.1 6.52,35.31 R8.2 C4.1
NRST  (via drill 0.35)
  Top 0.203: 9.91,110.87 17.65,110.87
  Top 0.254: D4.C 23.88,113.28 v23.62,113.03 | v18.16,111.38 17.65,110.87 | D1.C 7.87,114.43 J3.6 9.14,112.58 9.14,111.51 9.78,110.87 | 9.91,110.87 9.78,110.87 | 9.78,110.87 9.27,110.36 v9.27,107.7 | v10.92,94.74 10.92,85.09 9.02,83.19 D2.C v9.01,55.88 | v9.01,55.88 D3.C | U$8.2 11.48,55.88 v9.01,55.88
  Bottom 0.254: v23.62,113.03 23.49,112.9 19.68,112.9 v18.16,111.38 | v9.27,107.7 9.27,106.3 10.92,104.65 v10.92,94.74 | v9.01,55.88 R9.1
NRST_1
  Top 0.254: U$1.6 10.55,111.87 D1.A
NRST_2
  Top 0.254: D2.A 13.59,77.85 U$2.6
NRST_3
  Top 0.254: U$3.6 13.09,37.07 D3.A
NRST_4  (via drill 0.35)
  Top 0.254: D4.A v30.35,113.28
  Bottom 0.254: U$4.13 56.42,111.51 32.13,111.51 v30.35,113.28
PROG_1
  Top 0.254: MUX.10 11.51,128.08 J3.2
PROG_3
  Top 0.254: J3.4 5.59,121.14 5.59,127 7.94,129.35 MUX.9
SHIELD_1
  Top 0.254: C1.1 11.34,21.4 R2.2 7.82,21.53 J1.4
SHIELD_2
  Top 0.254: R3.2 C2.1 10.51,7.49 J4.4
SHIELD_3
  Top 0.254: R6.2 75.78,12.57 C3.1 78.81,14.67 J5.4
SOL1_1
  Top 0.762: U$4.2 80.12,125.2 J8.8
SOL2_1
  Top 0.762: U$4.1 76.93,119.35 80.28,122.7 J8.7
SOL3_1
  Top 0.762: U$4.3 75.85,117.76 77.88,117.76 80.32,120.2 J8.6
SOL4_1
  Top 0.762: U$4.5 75.1,116.51 79.24,116.51 J8.5
SOL5_1
  Top 0.762: U$4.7 74.42,115.19 80.42,115.19 J8.4
SOL6_1
  Top 0.762: J8.3 74.91,112.7 U$4.9
SWCLK_1  (via drill 0.35)
  Top 0.254: MUX.12 19.54,125.54 20.07,125.02 20.07,123.5 21.39,122.17 v21.39,111.18
  Bottom 0.254: v21.39,111.18 16.08,105.87 U$1.11
SWCLK_2  (via drill 0.35)
  Top 0.254: MUX.14 19.88,123 20.68,122.19 20.68,110.38 v21.34,109.73 | v22.86,95.25 22.86,76.61 v22.88,76.58
  Bottom 0.203: U$2.11 20.96,75.92 22.22,75.92 v22.88,76.58
  Bottom 0.254: v21.34,109.73 22.86,108.2 v22.86,95.25
SWCLK_3  (via drill 0.35)
  Top 0.254: MUX.15 19.62,121.73 19.94,121.41 19.94,108.84 v20.07,108.71 | v21.59,95.25 21.59,73.31 21.58,73.31 21.59,73.3 v21.59,44.32
  Bottom 0.254: v20.07,108.71 21.59,107.19 v21.59,95.25 | v21.59,44.32 21.64,44.27 21.64,34.34 18.37,31.07 U$3.11
SWCLK_4  (via drill 0.35)
  Top 0.254: v21.34,126.11 20.64,126.81 MUX.11
  Bottom 0.254: v21.34,126.11 24.13,126.11 35.81,114.43 51.56,114.43 53.39,116.25 53.39,121.84 54.86,123.32 64.3,123.32 U$4.12
SWCLK_IN  (via drill 0.35)
  Top 0.254: MUX.13 11.37,124.27 9.65,122.56 v9.65,120.9
  Bottom 0.254: J3.7 9.65,113.72 v9.65,120.9
SWDIO_1
  Top 0.254: U$1.9 20.62,107.87 22.73,109.98 22.73,120.24 MUX.1
SWDIO_2  (via drill 0.35)
  Top 0.254: MUX.5 23.08,125.42 25.1,125.42 25.88,124.64 v25.88,121.89 | v25.91,111.76 18.16,104.01 18.16,75.12 U$2.9
  Bottom 0.254: v25.88,121.89 25.88,111.78 v25.91,111.76
SWDIO_3  (via drill 0.35)
  Top 0.254: U$3.9 20,36.96 23.37,36.96 25.91,39.5 25.91,108.97 27.69,110.74 v27.69,111.25 | MUX.2 24.73,121.73 27.69,118.77 v27.69,118.11
  Bottom 0.254: v27.69,118.11 v27.69,111.25
SWDIO_4  (via drill 0.35)
  Top 0.254: MUX.4 24.57,124.27 v24.64,124.21
  Bottom 0.254: U$4.14 63.18,122.43 55.12,122.43 54.1,121.41 54.1,115.57 52.32,113.79 35.18,113.79 24.76,124.21 v24.64,124.21
SWDIO_IN  (via drill 0.35)
  Top 0.254: v21.13,123.77 21.91,123 MUX.3
  Bottom 0.254: v21.13,123.77 12.14,123.77 10.67,122.3 10.67,112.23 J3.8

### Text on the board
tNames: GND - CAN_L - CAN_H - 3.3V | GND - CAN_L - CAN_H - 5V | 5V - 5V - GND - SHLD | ROV X13 Backplane v1 / Kaitlyn Yu / Read Hedl / Grant Geyer / 1/8/12 | 5V - 5V - GND - SHLD | 5V - 5V - GND - SHLD